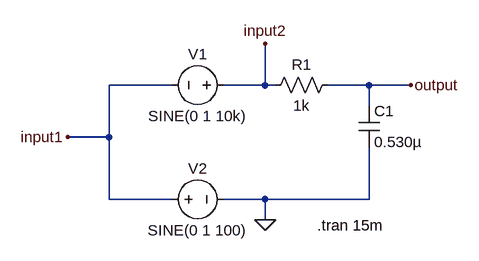
[diagram p0: schematic low-pass-analysis.asc]
low-pass-analysis.asc, the LTspice schematic file:
Version 4
SHEET 1 880 680
WIRE 32 96 -64 96
WIRE 176 96 176 32
WIRE 176 96 112 96
WIRE 192 96 176 96
WIRE 336 96 272 96
WIRE 400 96 336 96
WIRE 336 128 336 96
WIRE -64 176 -64 96
WIRE -64 176 -128 176
WIRE -64 272 -64 176
WIRE 32 272 -64 272
WIRE 176 272 112 272
WIRE 336 272 336 192
WIRE 336 272 176 272
WIRE 176 304 176 272
FLAG 176 304 0
FLAG 400 96 output
FLAG -128 176 input1
FLAG 176 32 input2
SYMBOL res 288 80 R90
WINDOW 0 0 56 VBottom 2
WINDOW 3 32 56 VTop 2
SYMATTR InstName R1
SYMATTR Value 1k
SYMBOL cap 320 128 R0
SYMATTR InstName C1
SYMATTR Value 0.530µ
SYMBOL voltage 128 96 R90
WINDOW 0 -32 56 VBottom 2
WINDOW 3 32 56 VTop 2
WINDOW 123 0 0 Left 0
WINDOW 39 0 0 Left 0
SYMATTR InstName V1
SYMATTR Value SINE(0 1 10k)
SYMBOL voltage 16 272 R270
WINDOW 0 32 56 VTop 2
WINDOW 3 -32 56 VBottom 2
WINDOW 123 0 0 Left 0
WINDOW 39 0 0 Left 0
SYMATTR InstName V2
SYMATTR Value SINE(0 1 100)
TEXT 256 312 Left 2 !.tran 15m

The netlist it stands for:
* low-pass-analysis.asc
R1 output input2 1k
C1 output 0 0.530µ
V1 input2 input1 SINE(0 1 10k)
V2 input1 0 SINE(0 1 100)
.tran 15m
.backanno
.end

* Results of the author's LTspice run, read from the files saved beside the schematic
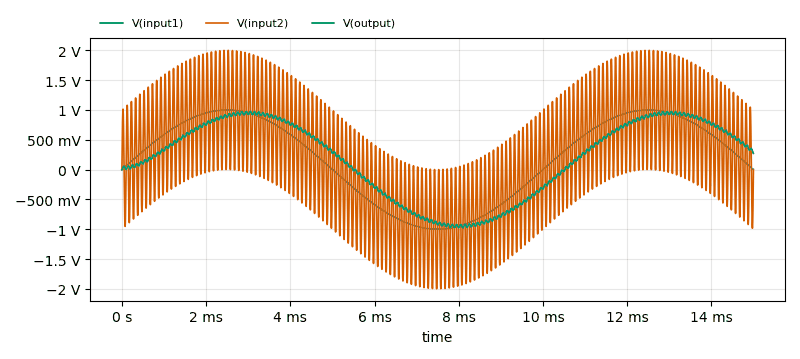
[diagram p1: Transient Analysis of low-pass-analysis.asc, plotted from the saved traces]
* Transient Analysis, 1 run:
*   V(input1): min -1 V, max 1 V, average 212.2 mV, rms 707.1 mV, last 0 V
*   V(input2): min -1.999 V, max 1.999 V, average 212.2 mV, rms 1.008 V, last 0 V
*   V(output): min -975.7 mV, max 976.5 mV, average 202.7 mV, rms 672.6 mV, last 270 mV